# Altium schematic sheet 02_nRF52840_power_clock.SchDoc
size 420 x 297 mm; Author: Shpakov Dmitry; Address1: Address1; Address2: Address2; Address3: Address3; Address4: Address4; DocumentNumber: АБВГ.123456.001 Э3; SheetNumber: 3; SheetTotal: 13; Scale: 1:1; DocumentType: Схема электрическая принципиальная; FirstReferrence: АБВГ.123456.001
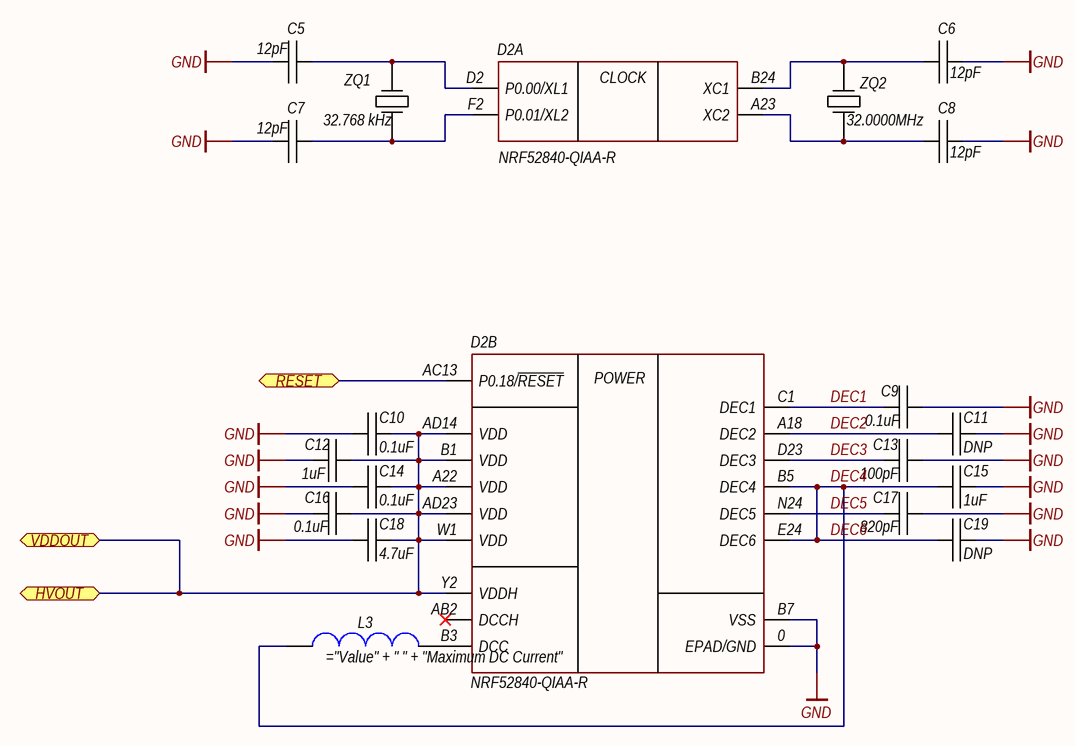
[diagram p0: 02_nRF52840_power_clock.SchDoc]

## Parts
C5  12pF  [CAPC1608X09N]
C6  12pF  [CAPC1608X09N]
C7  12pF  [CAPC1608X09N]
C8  12pF  [CAPC1608X09N]
C9  0.1uF  [CAPC1608X09N]
C10  0.1uF  [CAPC1608X09N]
C11  DNP  [CAPC1608X09N]
C12  1uF  [CAPC1608X09N]
C13  100pF  [CAPC1608X09N]
C14  0.1uF  [CAPC1608X09N]
C15  1uF  [CAPC1608X09N]
C16  0.1uF  [CAPC1608X09N]
C17  820pF  [CAPC1608X09N]
C18  4.7uF  [CAPC1608X09N]
C19  DNP  [CAPC1608X09N]
D2  NRF52840-QIAA-R  [AQFN50P700X700X85_HS-74N]  (parts A,B of 9)
L3  (no value)  [INDC1608X08N]
ZQ1  32.768 kHz  [ECX-16]
ZQ2  32.0000MHz  [ABM11W-32.0000MHZ-8-D1X-T3]

## Ports
HVOUT, RESET, VDDOUT

## Nets
GND: C5.1 C6.2 C7.1 C8.2 C9.2 C10.1 C11.2 C12.1 C13.2 C14.1 C15.2 C16.1 C17.2 C18.1 C19.2 D2.0(EPAD/GND) D2.B7(VSS) ZQ2.2 ZQ2.4
DEC1: C9.1 D2.C1(DEC1)
DEC2: C11.1 D2.A18(DEC2)
DEC3: C13.1 D2.D23(DEC3)
DEC4: C15.1 C19.1 D2.B5(DEC4) D2.E24(DEC6) L3.1  [also labelled DEC6]
DEC5: C17.1 D2.N24(DEC5)
HVOUT: C10.2 C12.2 C14.2 C16.2 C18.2 D2.A22(VDD) D2.AD14(VDD) D2.AD23(VDD) D2.B1(VDD) D2.W1(VDD) D2.Y2(VDDH) ; port HVOUT, port VDDOUT
RESET: D2.AC13(P0.18/~{RESET}) ; port RESET
NetC5_2: C5.2 D2.D2(P0.00/XL1) ZQ1.2
NetC6_1: C6.1 D2.B24(XC1) ZQ2.3
NetC7_2: C7.2 D2.F2(P0.01/XL2) ZQ1.1
NetC8_1: C8.1 D2.A23(XC2) ZQ2.1
NetD2_B3: D2.B3(DCC) L3.2

Not connected (* = marked no-connect by the designer): D2 AB2(DCCH)*

## Notes on the sheet
- Author
- Manufacturer
- Date
- Page
- Total pages
- Size page
- A3
- Materials
- (in symbol nRF52840-QFN373, part A) CLOCK
- (in symbol nRF52840-QFN373, part B) POWER

## Library data of the parts
C5-C8 = Ceramic: Ceramic capacitor; Manufacturer: Yageo; PartNumber: CC0603JRNPO9BN120; Power/Voltage: 50V; Tolerance: 5%; Operation Temperature: -55...+125; Help URL: https://www.digikey.com/en/products/detail/yageo/CC0603JRNPO9BN120/302793; Type: capacitor; Value: 12pF; Note: *; Case: 0603
C9 C10 C14 C16 = Ceramic: Ceramic capacitor; Manufacturer: Würth Elektronik; PartNumber: 885012206071; Power/Voltage: 25V; Tolerance: 10%; Operation Temperature: -55...+125; Help URL: https://www.digikey.com/en/products/detail/w%C3%BCrth-elektronik/885012206071/5453844; Type: capacitor; Value: 0.1uF; Note: *; Case: 0603
C11 C19 = Ceramic: Ceramic capacitor; Manufacturer: *; PartNumber: *; Help URL: *; Type: capacitor; Power/Voltage: *; Value: DNP; Tolerance: *; Operation Temperature: *; Note: *; Case: 0603
C12 C15 = Ceramic: Ceramic capacitor; Manufacturer: Würth Elektronik; PartNumber: 885012106010; Power/Voltage: 10V; Tolerance: 20%; Operation Temperature: -55...+85; Help URL: https://www.digikey.com/en/products/detail/w%C3%BCrth-elektronik/885012106010/5453762; Type: capacitor; Value: 1uF; Note: *; Case: 0603
C13 = Ceramic: Ceramic capacitor; Manufacturer: Würth Elektronik; PartNumber: 885342006003; Power/Voltage: 250V; Tolerance: 5%; Operation Temperature: -55...+125; Help URL: https://www.digikey.com/en/products/detail/w%C3%BCrth-elektronik/885342006003/9345979; Type: capacitor; Value: 100pF; Note: *; Case: 0603
C17 = Ceramic: Ceramic capacitor; Manufacturer: Yageo; PartNumber: CC0603KRX7R9BB821; Power/Voltage: 50V; Tolerance: 10%; Operation Temperature: -55...+125; Help URL: https://www.digikey.com/en/products/detail/yageo/CC0603KRX7R9BB821/372862; Type: capacitor; Value: 820pF; Note: *; Case: 0603
C18 = Ceramic: Ceramic capacitor; Manufacturer: Würth Elektronik; PartNumber: 885012106005; Power/Voltage: 6.3V; Tolerance: 20%; Operation Temperature: -55...+85; Help URL: https://www.digikey.com/en/products/detail/w%C3%BCrth-elektronik/885012106005/5453757; Type: capacitor; Value: 4.7uF; Note: *; Case: 0603
D2 = nRF52840-QFN373: IC RF TxRx + MCU 802.15.4, Bluetooth Bluetooth v5.0 2.4GHz 73-VFQFN Dual Rows, Exposed Pad; Manufacturer: Nordic Semiconductor ASA; Power/Voltage: 1.7V ~ 5.5V; Operation Temperature: -40...+85; Help URL: https://www.digikey.com/en/products/detail/nexperia-usa-inc/2N7002-215/762973; Type: IC RF TXRX+MCU 802.15.4; Value: *; Tolerance: *; Note: *; Case: 73-aQFN (7x7); PartNumber: NRF52840-QIAA-R
L3 = Inductor: Manufacturer: Murata Electronics; PartNumber: LQM18FN100M00D; Value: 10 uH; Tolerance: 20 %; Operation Temperature: -55...+125; Maximum DC Current: 50 mA; Maximum DC Resistance: 1.17 Ohm; Help URL: https://www.digikey.com/en/products/detail/murata-electronics/LQM18FN100M00D/1016184; Power/Voltage: *; Type: inductor; Note: *; Case: 0603; Saturation Current: 50 mA
ZQ1 = ECS-.327-9-16-TR: CRYSTAL 32.7680KHZ 9PF SMD ±20ppm Crystal 9pF 2-SMD, No Lead; Manufacturer: ECS Inc.; Operation Temperature: -40...+85; PartNumber: ECS-.327-9-16-TR; Help URL: https://www.digikey.com/en/products/detail/ecs-inc/ECS-327-9-16-TR/5875558; Power/Voltage: *; Type: crystal oscillator, tunning fork; Value: 32.768 kHz; Tolerance: 20ppm; Note: *; Case: 2-SMD, No Lead
ZQ2 = ABM11W-32.0000MHZ-8-D1X-T3: CRYSTAL 32.0000MHZ 8PF SMD, ±10ppm Crystal 8pF 4-SMD, No Lead; Manufacturer: Abracon LLC; Operation Temperature: -40...+85; PartNumber: ABM11W-32.0000MHZ-8-D1X-T3; Help URL: https://www.digikey.com/en/products/detail/abracon-llc/ABM11W-32-0000MHZ-8-D1X-T3/7172671; Power/Voltage: *; Type: crystal oscillator; Value: 32.0000MHz; Tolerance: 10ppm; Note: *; Case: 4-SMD, No Lead